# Altium schematic sheet Low-Voltage Power Supply.SchDoc
size A4
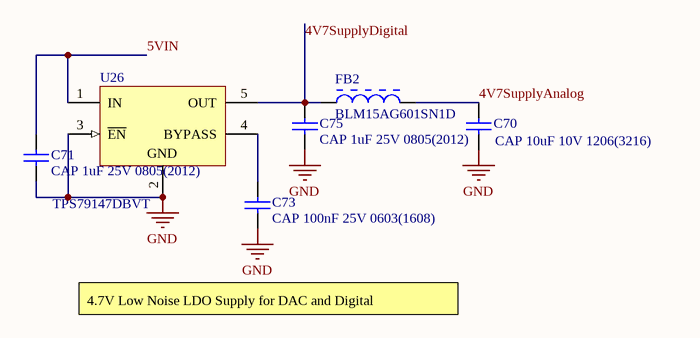
[diagram p0: Low-Voltage Power Supply.SchDoc]

## Parts
C70  CAP 10uF 10V 1206(3216)  [CAPC1206(3216)130_L]
C71  CAP 1uF 25V 0805(2012)  [CAPC0805(2012)145_N]
C73  CAP 100nF 25V 0603(1608)  [CAPC0603(1608)100_N]
C75  CAP 1uF 25V 0805(2012)  [CAPC0805(2012)145_N]
FB2  BLM15AG601SN1D  [MURA-BLM15-CHIP-2_V]
U26  TPS79147DBVT  [TI-DBV5_N]

## Nets
GND: C70.1 C71.1 C73.2 C75.2 U26.2(GND) U26.3(~{EN})
4V7SupplyAnalog: C70.2 FB2.2
4V7SupplyDigital: C75.1 FB2.1 U26.5(OUT)
5VIN: C71.2 U26.1(IN)
NetC73_1: C73.1 U26.4(BYPASS)

## Notes on the sheet
- 4.7V Low Noise LDO Supply for DAC and Digital

## Library data of the parts
C70 = CMP-1037-04970-1: CAP 10uF 10V -20% to +80% 1206 (3216 Metric) Thickness 1.3mm SMD; Case-Metric: 3216; Case-EIA: 1206; Value: 10uF; Rated Voltage: 10 V; Technology: SMT; Max Thickness: 1.3 mm; Tolerance: -20% to +80%
C71 C75 = CMP-1036-04753-1: CAP 1uF 25V ±10% 0805 (2012 Metric) Thickness 1.45mm SMD; Case-EIA: 0805; Case-Metric: 2012; Tolerance: Â±10%; Max Thickness: 1.45 mm; Value: 1uF; Rated Voltage: 25 V; Technology: SMT
C73 = CMP-1035-02589-1: CAP 100nF 25V ±20% 0603 (1608 Metric) Thickness 1mm SMD; Case-EIA: 0603; Tolerance: Â±20%; Case-Metric: 1608; Value: 100nF; Max Thickness: 1 mm; Technology: SMT; Rated Voltage: 25 V
FB2 = CMP-0686-00187-3: Chip Ferrite Bead for General Use, 600 Ohm, 300 mA, -55 to 125 degC, 1 x 0.5 x 0.55 mm SMD, Tape and Reel; Manufacturer: Murata; Impedance (at 100 MHz): 600 Ohm +/- 25%; DC Resistance: 0.52 Ohm Max.; Rated Current: 300 mA; PackageDescription: 2-Pin Chip, Body 1 x 0.5 mm; Mounting Technology: Surface Mount; ComponentLink1Description: Manufacturer URL; ComponentLink3Description: Package Specification; ComponentLink2Description: Datasheet; Operating Temperature Range: -55 to 125 degC; Packing: Tape and Reel; ComponentLink1URL: http://www.murata.com/; PackageReference: BLM15-2; DatasheetVersion: 08/2013; PartNumber: BLM15AG601SN1D; ComponentLink3URL: http://www.murata.com/products/catalog/pdf/c31e.pdf; ComponentLink2URL: http://www.murata.com/products/catalog/pdf/c31e.pdf
U26 = CMP-0394-00191-1: Single Output High PSRR LDO, 100 mA, Fixed 4.7 V Output, 2.7 to 5.5 V Input, 5-pin SOT-23 (DBV), -40 to 125 degC, Green (RoHS & no Sb/Br); Manufacturer: Texas Instruments; Accuracy(%): 2; Iout(Max)(A): 0.1; Vin(Max)(V): 5.5; Vin(Min)(V): 2.7; Iq(Typ)(mA): 0.2; Vout Adj(Max)(V): 4.7; SubFamily: Single Channel LDO; Vdo(Typ)(mV): 38; ComponentLink1URL: http://www.ti.com/; ComponentLink3URL: http://www.ti.com/litv/pdf/mpds018i; PackageVersion: 4073253-4/K; PartNumber: TPS79147DBVT; ComponentLink2Description: Datasheet; PackageReference: DBV5; Code_JEDEC: MO-178; PackageDescription: 5-Pin Plastic Small Outline, Body 1.60 Ãƒâ€” 2.90 mm, Pitch 0.95 mm; Vout Adj(Min)(V): 4.7; DatasheetVersion: SLVS325C; ComponentLink2URL: http://www.ti.com/general/docs/lit/getliterature.tsp?genericPartNumber=TPS79147&fileType=pdf; ComponentLink3Description: Package Specification; Eco-Plan: Green (RoHS & no Sb/Br); ComponentLink1Description: Manufacturer URL; Mounting Technology: Surface Mount; Fixed Output Options(V): 4.7